# Altium schematic sheet 201_GridPos2.SchDoc
size A2; Organization: Greenfield Tech Solutions; Address1: Molendreef 33; Address2: Ossendrecht; Address3: 4641CS; Address4: The Netherlands; SheetNumber: 2; SheetTotal: 7
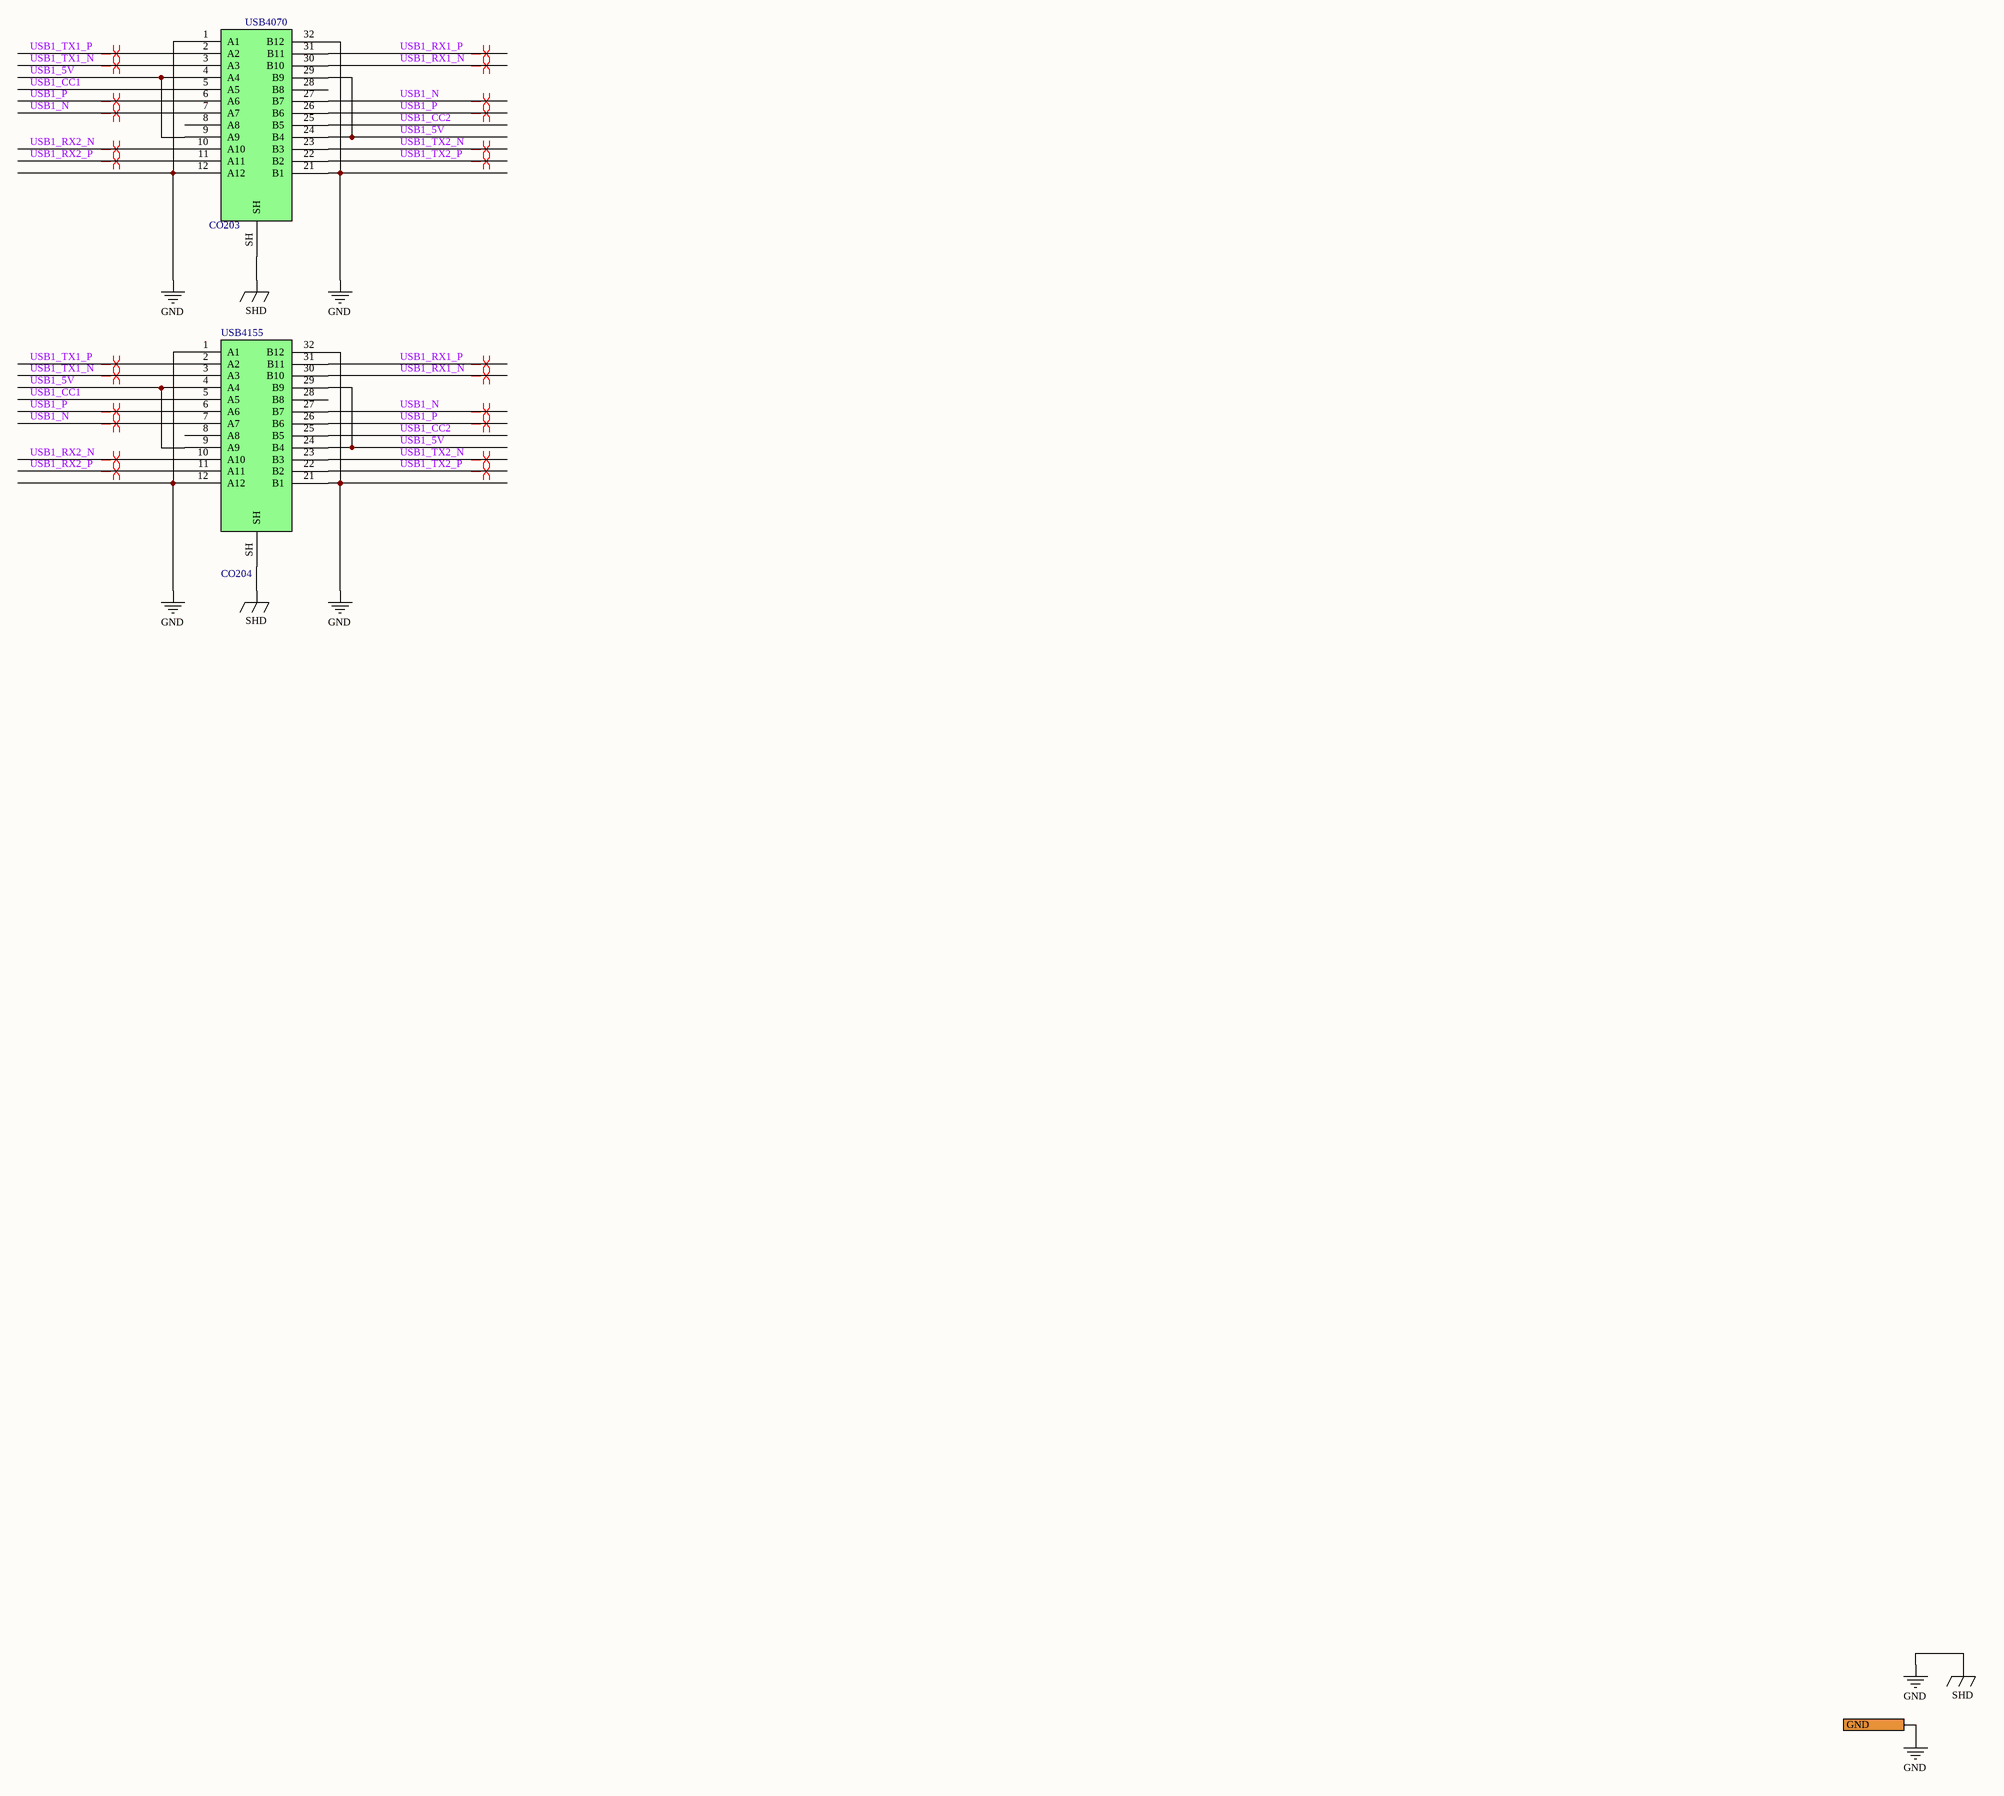
[diagram p0: 201_GridPos2.SchDoc]

## Parts
CO203  USB4070  [USB4070-30-C]
CO204  USB4155  [USB4155-03-C]

## Ports
GND

## Nets
GND: CO203.1(A1) CO203.12(A12) CO203.21(B1) CO203.32(B12) CO203.SH CO204.1(A1) CO204.12(A12) CO204.21(B1) CO204.32(B12) CO204.SH ; port GND  [also labelled SHD]
USB1_5V: CO203.4(A4) CO203.9(A9) CO203.24(B4) CO203.29(B9) CO204.4(A4) CO204.9(A9) CO204.24(B4) CO204.29(B9)
USB1_CC1: CO203.5(A5) CO204.5(A5)
USB1_CC2: CO203.25(B5) CO204.25(B5)
USB1_N: CO203.7(A7) CO203.27(B7) CO204.7(A7) CO204.27(B7)
USB1_P: CO203.6(A6) CO203.26(B6) CO204.6(A6) CO204.26(B6)
USB1_RX1_N: CO203.30(B10) CO204.30(B10)
USB1_RX1_P: CO203.31(B11) CO204.31(B11)
USB1_RX2_N: CO203.10(A10) CO204.10(A10)
USB1_RX2_P: CO203.11(A11) CO204.11(A11)
USB1_TX1_N: CO203.3(A3) CO204.3(A3)
USB1_TX1_P: CO203.2(A2) CO204.2(A2)
USB1_TX2_N: CO203.23(B3) CO204.23(B3)
USB1_TX2_P: CO203.22(B2) CO204.22(B2)

Not connected (* = marked no-connect by the designer): CO203 8(A8) 28(B8); CO204 8(A8) 28(B8)

## Layout directives
differential pair; differential pair class USB3: USB1_N, USB1_P, USB1_RX1_N, USB1_RX1_P, USB1_RX2_N, USB1_RX2_P, USB1_TX1_N, USB1_TX1_P, USB1_TX2_N, USB1_TX2_P

## Notes on the sheet
- Title
- Size:
- Date:
- File:
- A2
- Number:
- Time:
- Revision:
- Sheet
- of

## Library data of the parts
CO203 = CO0021: USB C connector Receptacle Vertical; Part Number: CO0021; ID: 16; RefVal: USB4070; ManfactPart: USB4070-30-C
CO204 = CO0031: USB C connector Plug Horizontal; Part Number: CO0031; ID: 30; RefVal: USB4155; ManfactPart: USB4155-03-C